# EAGLE schematic V2.1_BMS (EAGLE 9.6.2)

## Sheet 1 of 7: ISOLATED SUPPLY
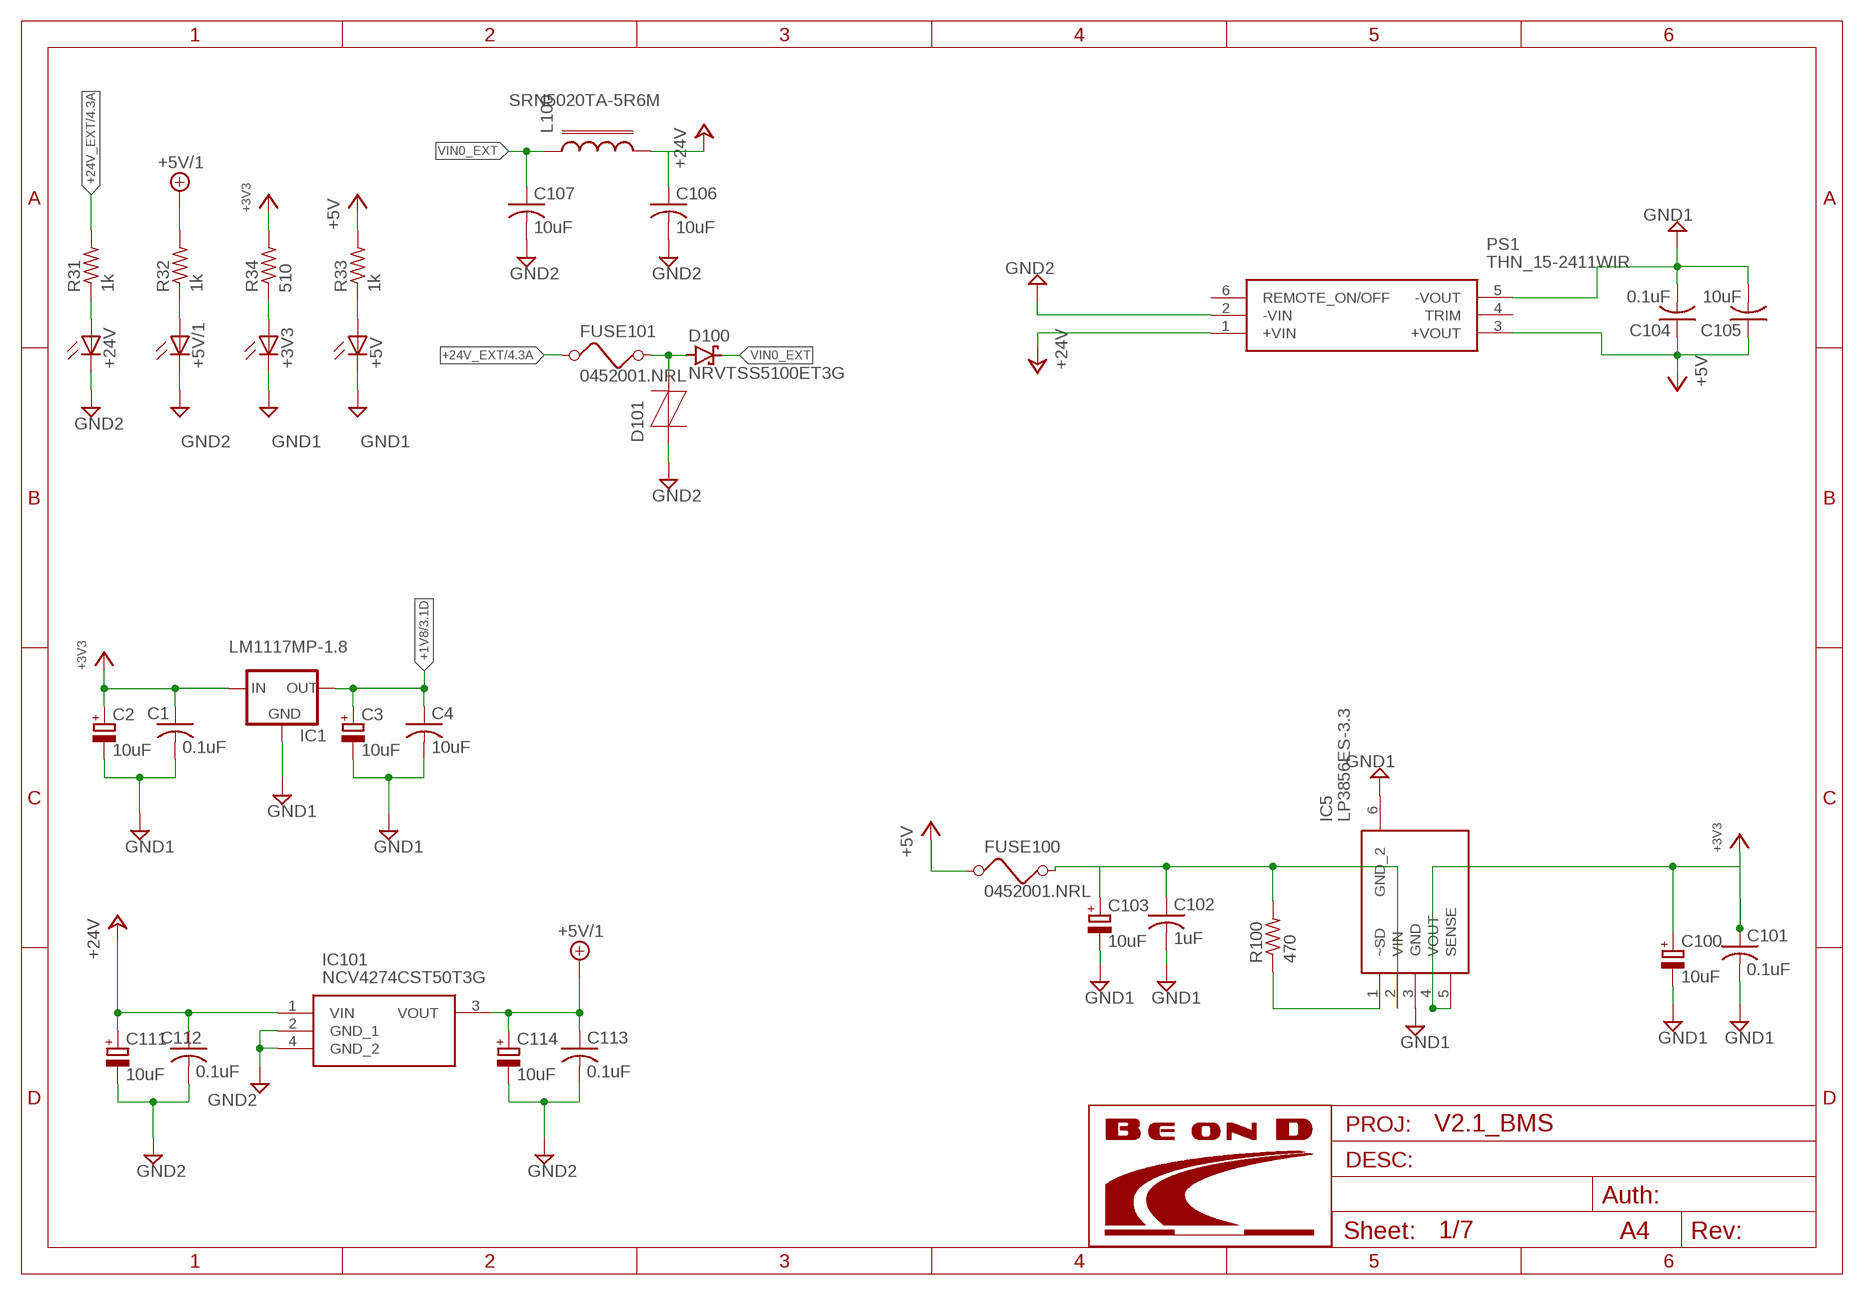
[diagram p0: schematic, sheet 1]

### Parts
+3V3  LED0603  [LED-0603]
+5V  LED0603  [LED-0603]
+5V/1  LED0603  [LED-0603]
+24V  LED0603  [LED-0603]
C1  0.1uF  CAPACITORBEOND_0603  [0603_INCH:1]
C2  10uF  C-POL_TANTALUM-1411(3528-METRIC)  [CAPMP3528X210N]
C3  10uF  C-POL_TANTALUM-1411(3528-METRIC)  [CAPMP3528X210N]
C4  10uF  CAPACITORBEOND_0603  [0603_INCH:1]
C100  10uF  C-POL_TANTALUM-1411(3528-METRIC)  [CAPMP3528X210N]
C101  0.1uF  CAPACITORBEOND_0603  [0603_INCH:1]
C102  1uF  CAPACITORBEOND_0603  [0603_INCH:1]
C103  10uF  C-POL_TANTALUM-1411(3528-METRIC)  [CAPMP3528X210N]
C104  0.1uF  CAPACITORBEOND_0603  [0603_INCH:1]
C105  10uF  CAPACITORBEOND_0603  [0603_INCH:1]
C106  10uF  CAPACITORBEOND_0603  [0603_INCH:1]
C107  10uF  CAPACITORBEOND_0603  [0603_INCH:1]
C111  10uF  C-POL_TANTALUM-1411(3528-METRIC)  [CAPMP3528X210N]
C112  0.1uF  CAPACITORBEOND_0603  [0603_INCH:1]
C113  0.1uF  CAPACITORBEOND_0603  [0603_INCH:1]
C114  10uF  C-POL_TANTALUM-1411(3528-METRIC)  [CAPMP3528X210N]
D100  NRVTSS5100ET3G  [LIBRARY_DIODES_FUSE_SMB-2]
D101  P0300SCLRP  [LIBRARY_DIODES_FUSE_SMB]
FUSE100  0452001.NRL  045201.5MRL  [LIBRARY_DIODES_FUSE_452_454]
FUSE101  0452001.NRL  045201.5MRL  [LIBRARY_DIODES_FUSE_452_454]
IC1  LM1117MP-1.8  [SOT223:1]
IC5  LP3856ES-3.3  [TO170P1435X465-6N]
IC101  NCV4274CST50T3G  [SOT223]
L100  SRN5020TA-5R6M  [LIBRARY_DIODES_FUSE_L_5X5]
PS1  THN_15-2411WIR  [THN152415WIR]
R31  1k  RESISTOR0603  [0603_INCH]
R32  1k  RESISTOR0603  [0603_INCH]
R33  1k  RESISTOR0603  [0603_INCH]
R34  510  RESISTOR0603  [0603_INCH]
R100  470  RESISTOR0603  [0603_INCH]

### Nets
+1V8: C3.1(+) C4.1 IC1.2(OUT) IC1.4(OUT) ; also sheet 3
+3V3: C1.1 C2.1(+) C100.1(+) C101.1 IC1.3(IN) IC5.4(VOUT) IC5.5(SENSE) R34.2 ; also sheet 2,3,4,5,6,7
+5V: C104.1 C105.1 FUSE100.P$1 PS1.3(+VOUT) R33.2 ; also sheet 3
+5V/1: C113.1 C114.1(+) IC101.3(VOUT) R32.2 ; also sheet 4
+24V: C106.1 C111.1(+) C112.1 IC101.1(VIN) L100.P$2 PS1.1(+VIN)
+24V_EXT: FUSE101.P$1 R31.2 ; also sheet 4
GND1: +3V3.C +5V.C C1.2 C2.2(-) C3.2(-) C4.2 C100.2(-) C101.2 C102.2 C103.2(-) C104.2 C105.2 IC1.1(GND) IC5.3(GND) IC5.6(GND_2) PS1.5(-VOUT) ; also sheet 2,3,4,5,6,7
GND2: +5V/1.C +24V.C C106.2 C107.2 C111.2(-) C112.2 C113.2 C114.2(-) D101.2(T) IC101.2(GND_1) IC101.4(GND_2) PS1.2(-VIN) ; also sheet 4
N$1: C102.1 C103.1(+) FUSE100.P$2 IC5.2(VIN) R100.2
N$2: D100.A D101.1(R) FUSE101.P$2
N$3: IC5.1(~SD) R100.1
N$23: +5V/1.A R32.1
N$24: +5V.A R33.1
N$35: +24V.A R31.1
N$36: +3V3.A R34.1
VIN0_EXT: C107.1 D100.C L100.P$1
Unconnected: PS1.4(TRIM) PS1.6(REMOTE_ON/OFF)

## Sheet 2 of 7: RGB LED
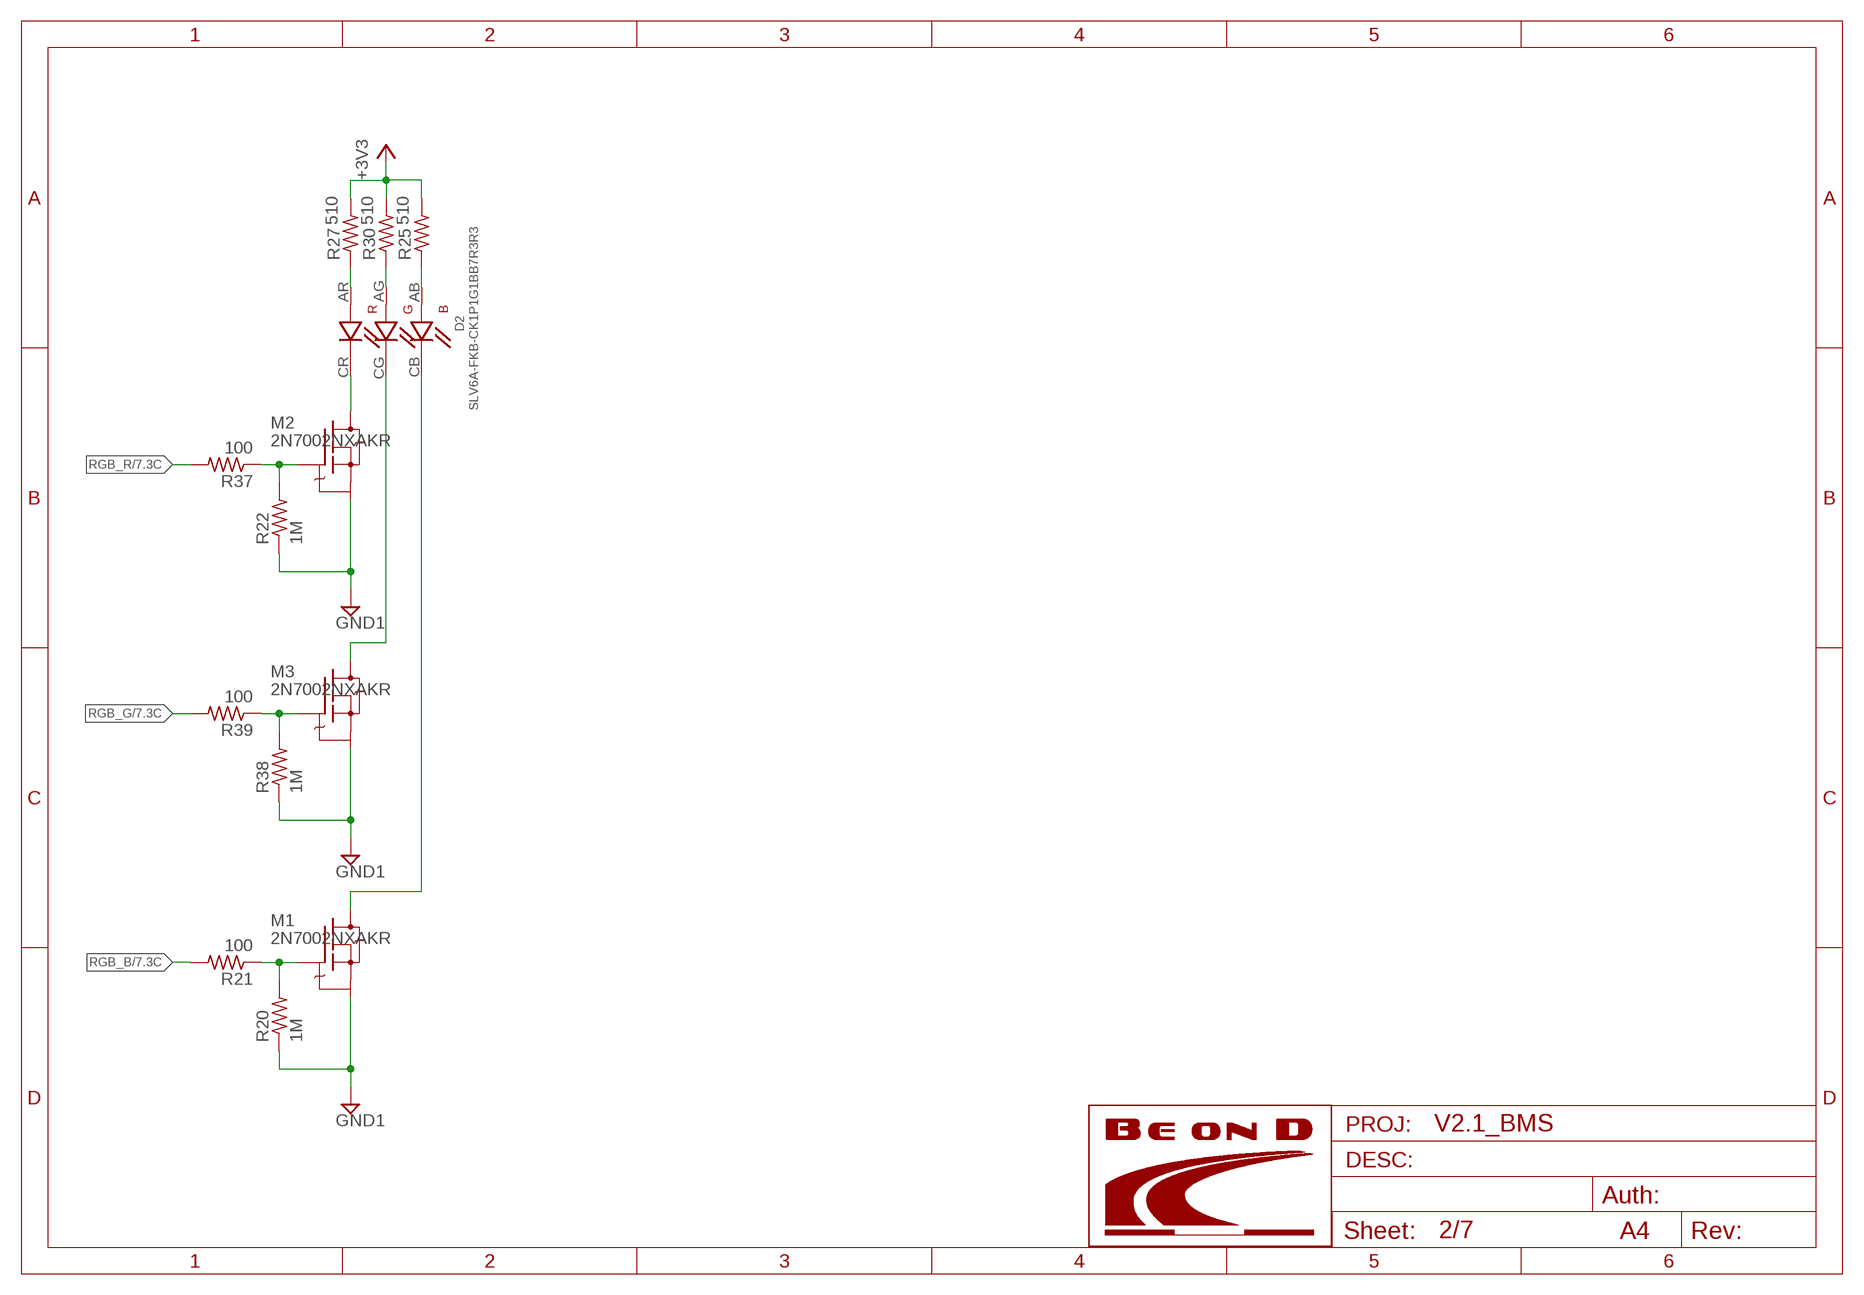
[diagram p1: schematic, sheet 2]

### Parts
D2  SLV6A-FKB-CK1P1G1BB7R3R3  [PLCC-6-LED_PLCC-6-LED]
M1  2N7002NXAKR  [BEOND_SOT23]
M2  2N7002NXAKR  [BEOND_SOT23]
M3  2N7002NXAKR  [BEOND_SOT23]
R20  1M  RESISTOR0603  [0603_INCH]
R21  100  RESISTOR0603  [0603_INCH]
R22  1M  RESISTOR0603  [0603_INCH]
R25  510  RESISTOR0603  [0603_INCH]
R27  510  RESISTOR0603  [0603_INCH]
R30  510  RESISTOR0603  [0603_INCH]
R37  100  RESISTOR0603  [0603_INCH]
R38  1M  RESISTOR0603  [0603_INCH]
R39  100  RESISTOR0603  [0603_INCH]

### Nets
+3V3: R25.2 R27.2 R30.2 ; also sheet 1,3,4,5,6,7
GND1: M1.2(S) M2.2(S) M3.2(S) R20.1 R22.1 R38.1 ; also sheet 1,3,4,5,6,7
N$40: D2.AR(RA) R27.1
N$41: D2.AG(GA) R30.1
N$42: D2.AB(BA) R25.1
N$44: M3.1(G) R38.2 R39.1
N$45: D2.CG(GC) M3.3(D)
N$46: M1.1(G) R20.2 R21.1
N$47: D2.CB(BC) M1.3(D)
N$48: M2.1(G) R22.2 R37.1
N$49: D2.CR(RC) M2.3(D)
RGB_B: R21.2 ; also sheet 7
RGB_G: R39.2 ; also sheet 7
RGB_R: R37.2 ; also sheet 7

## Sheet 3 of 7: PCIE LTE MODULE
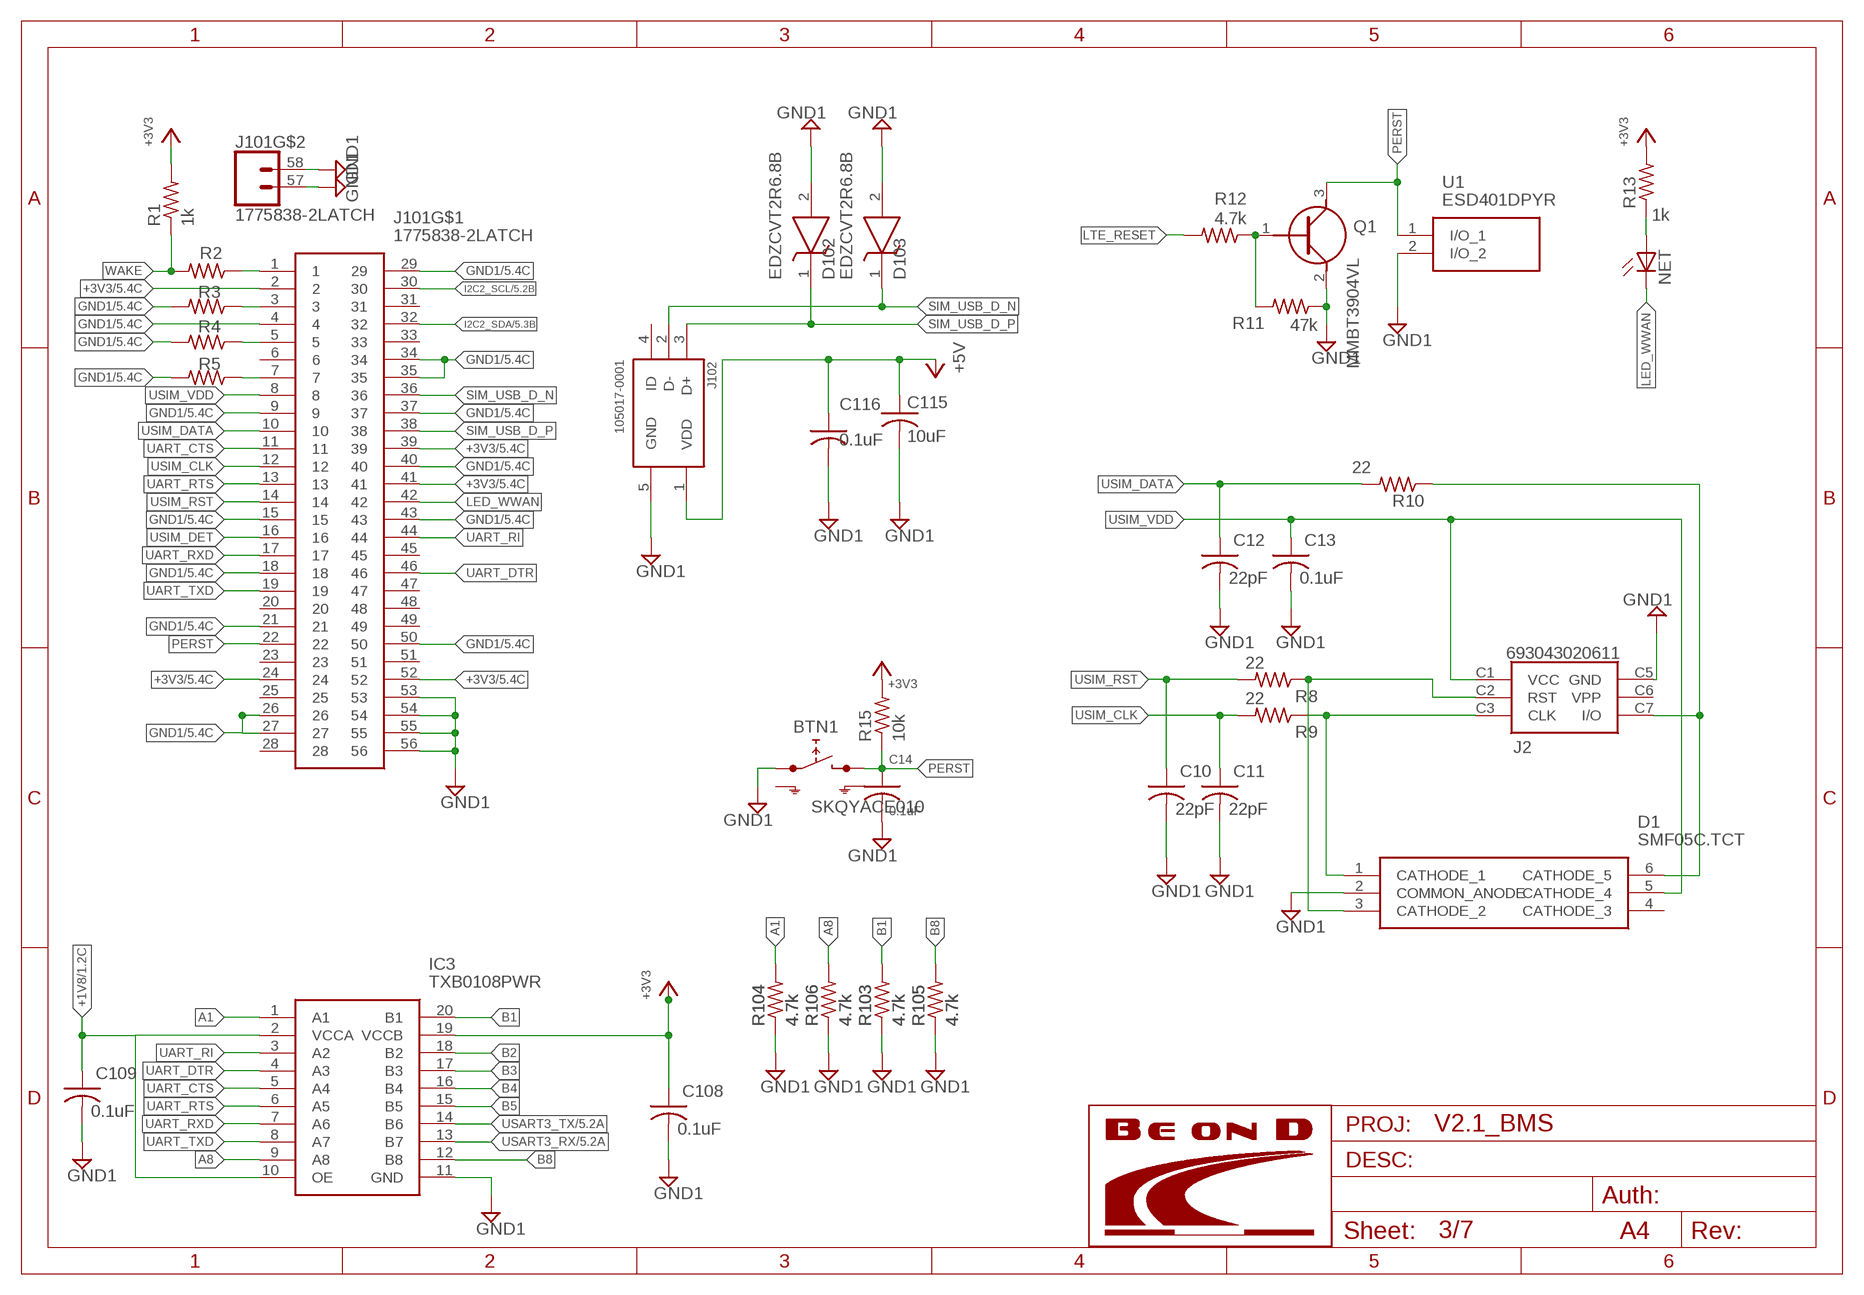
[diagram p2: schematic, sheet 3]

### Parts
BTN1  SKQYACE010  [BOTON_LED_SKQYACE010]
C10  22pF  CAPACITORBEOND_0603  [0603_INCH:1]
C11  22pF  CAPACITORBEOND_0603  [0603_INCH:1]
C12  22pF  CAPACITORBEOND_0603  [0603_INCH:1]
C13  0.1uF  CAPACITORBEOND_0603  [0603_INCH:1]
C14  0.1uF  CAPACITORBEOND_0603  [0603_INCH:1]
C108  0.1uF  CAPACITORBEOND_0603  [0603_INCH:1]
C109  0.1uF  CAPACITORBEOND_0603  [0603_INCH:1]
C115  10uF  CAPACITORBEOND_0603  [0603_INCH:1]
C116  0.1uF  CAPACITORBEOND_0603  [0603_INCH:1]
D1  SMF05C.TCT  [SOT65P210X110-6N]
D102  EDZCVT2R6.8B  [SODFL1608X70N]
D103  EDZCVT2R6.8B  [SODFL1608X70N]
IC3  TXB0108PWR  [SOP65P640X120-20N]
J2  693043020611  [693043020611]
J101  1775838-2LATCH  [17758382_LATCH]
J102  105017-0001  [MOLEX_105017-0001]
NET  LED0603  [LED-0603]
Q1  MMBT3904VL  [SOT95P230X110-3N]
R1  1k  RESISTOR0603  [0603_INCH]
R2  0  RESISTOR0603  [0603_INCH]
R3  0  RESISTOR0603  [0603_INCH]
R4  0  RESISTOR0603  [0603_INCH]
R5  0  RESISTOR0603  [0603_INCH]
R8  22  RESISTOR0603  [0603_INCH]
R9  22  RESISTOR0603  [0603_INCH]
R10  22  RESISTOR0603  [0603_INCH]
R11  47k  RESISTOR0603  [0603_INCH]
R12  4.7k  RESISTOR0603  [0603_INCH]
R13  1k  RESISTOR0603  [0603_INCH]
R15  10k  RESISTOR0603  [0603_INCH]
R103  4.7k  RESISTOR0603  [0603_INCH]
R104  4.7k  RESISTOR0603  [0603_INCH]
R105  4.7k  RESISTOR0603  [0603_INCH]
R106  4.7k  RESISTOR0603  [0603_INCH]
U1  ESD401DPYR  [ESD401DPYR]

### Nets
+1V8: C109.1 IC3.2(VCCA) IC3.10(OE) ; also sheet 1
+3V3: C108.1 IC3.19(VCCB) J101.2 J101.24 J101.39 J101.41 J101.52 R1.2 R13.2 R15.2 ; also sheet 1,2,4,5,6,7
+5V: C115.1 C116.1 J102.1(VDD) ; also sheet 1
_USIM_CLK: D1.1(CATHODE_1) J2.C3(CLK) R9.1
_USIM_DATA: D1.6(CATHODE_5) J2.C7(I/O) R10.1
A1: IC3.1(A1) R104.2
A8: IC3.9(A8) R106.2
B1: IC3.20(B1) R103.2
B2: IC3.18(B2)
B3: IC3.17(B3)
B4: IC3.16(B4)
B5: IC3.15(B5)
B8: IC3.12(B8) R105.2
GND1: BTN1.1(1.1) C10.2 C11.2 C12.2 C13.2 C14.2 C108.2 C109.2 C115.2 C116.2 D1.2(COMMON_ANODE) D102.2(A) D103.2(A) IC3.11(GND) J2.C5(GND) J101.4 J101.9 J101.15 J101.18 J101.21 J101.26 J101.27 J101.29 J101.34 J101.35 J101.37 J101.40 J101.43 J101.50 J101.53 J101.54 J101.55 J101.56 J101.57 J101.58 J102.5(GND) Q1.2(E) R3.2 R4.2 R5.2 R11.1 R103.1 R104.1 R105.1 R106.1 U1.2(I/O_2) ; also sheet 1,2,4,5,6,7
I2C2_SCL: J101.30 ; also sheet 5,7
I2C2_SDA [uC]: J101.32 ; also sheet 5,7
LED_WWAN: J101.42 NET.C
LTE_RESET: R12.2
N$7: J101.3 R3.1
N$8: J101.5 R4.1
N$12: Q1.1(B) R11.2 R12.1
N$13: NET.A R13.1
N$15: D1.3(CATHODE_2) J2.C2(RST) R8.1
N$18: J101.7 R5.1
N$19: J101.1 R2.1
PERST: BTN1.2(2.1) C14.1 J101.22 Q1.3(C) R15.1 U1.1(I/O_1)
SIM_USB_D_N: D103.1(K) J101.36 J102.2(D-)
SIM_USB_D_P: D102.1(K) J101.38 J102.3(D+)
UART_CTS: IC3.5(A4) J101.11
UART_DTR: IC3.4(A3) J101.46
UART_RI: IC3.3(A2) J101.44
UART_RTS: IC3.6(A5) J101.13
UART_RXD: IC3.7(A6) J101.17
UART_TXD: IC3.8(A7) J101.19
USART3_RX: IC3.13(B7) ; also sheet 5,7
USART3_TX: IC3.14(B6) ; also sheet 5,7
USIM_CLK: C11.1 J101.12 R9.2
USIM_DATA: C12.1 J101.10 R10.2
USIM_DET: J101.16
USIM_RST: C10.1 J101.14 R8.2
USIM_VDD: C13.1 D1.5(CATHODE_4) J2.C1(VCC) J101.8
WAKE: R1.1 R2.2
Unconnected: BTN1.GND1(SH) BTN1.GND2(SH1) D1.4(CATHODE_3) J2.C6(VPP) J101.6 J101.20 J101.23 J101.25 J101.28 J101.31 J101.33 J101.45 J101.47 J101.48 J101.49 J101.51 J102.4(ID)

## Sheet 4 of 7: ISOLATED CAN INTERFACE
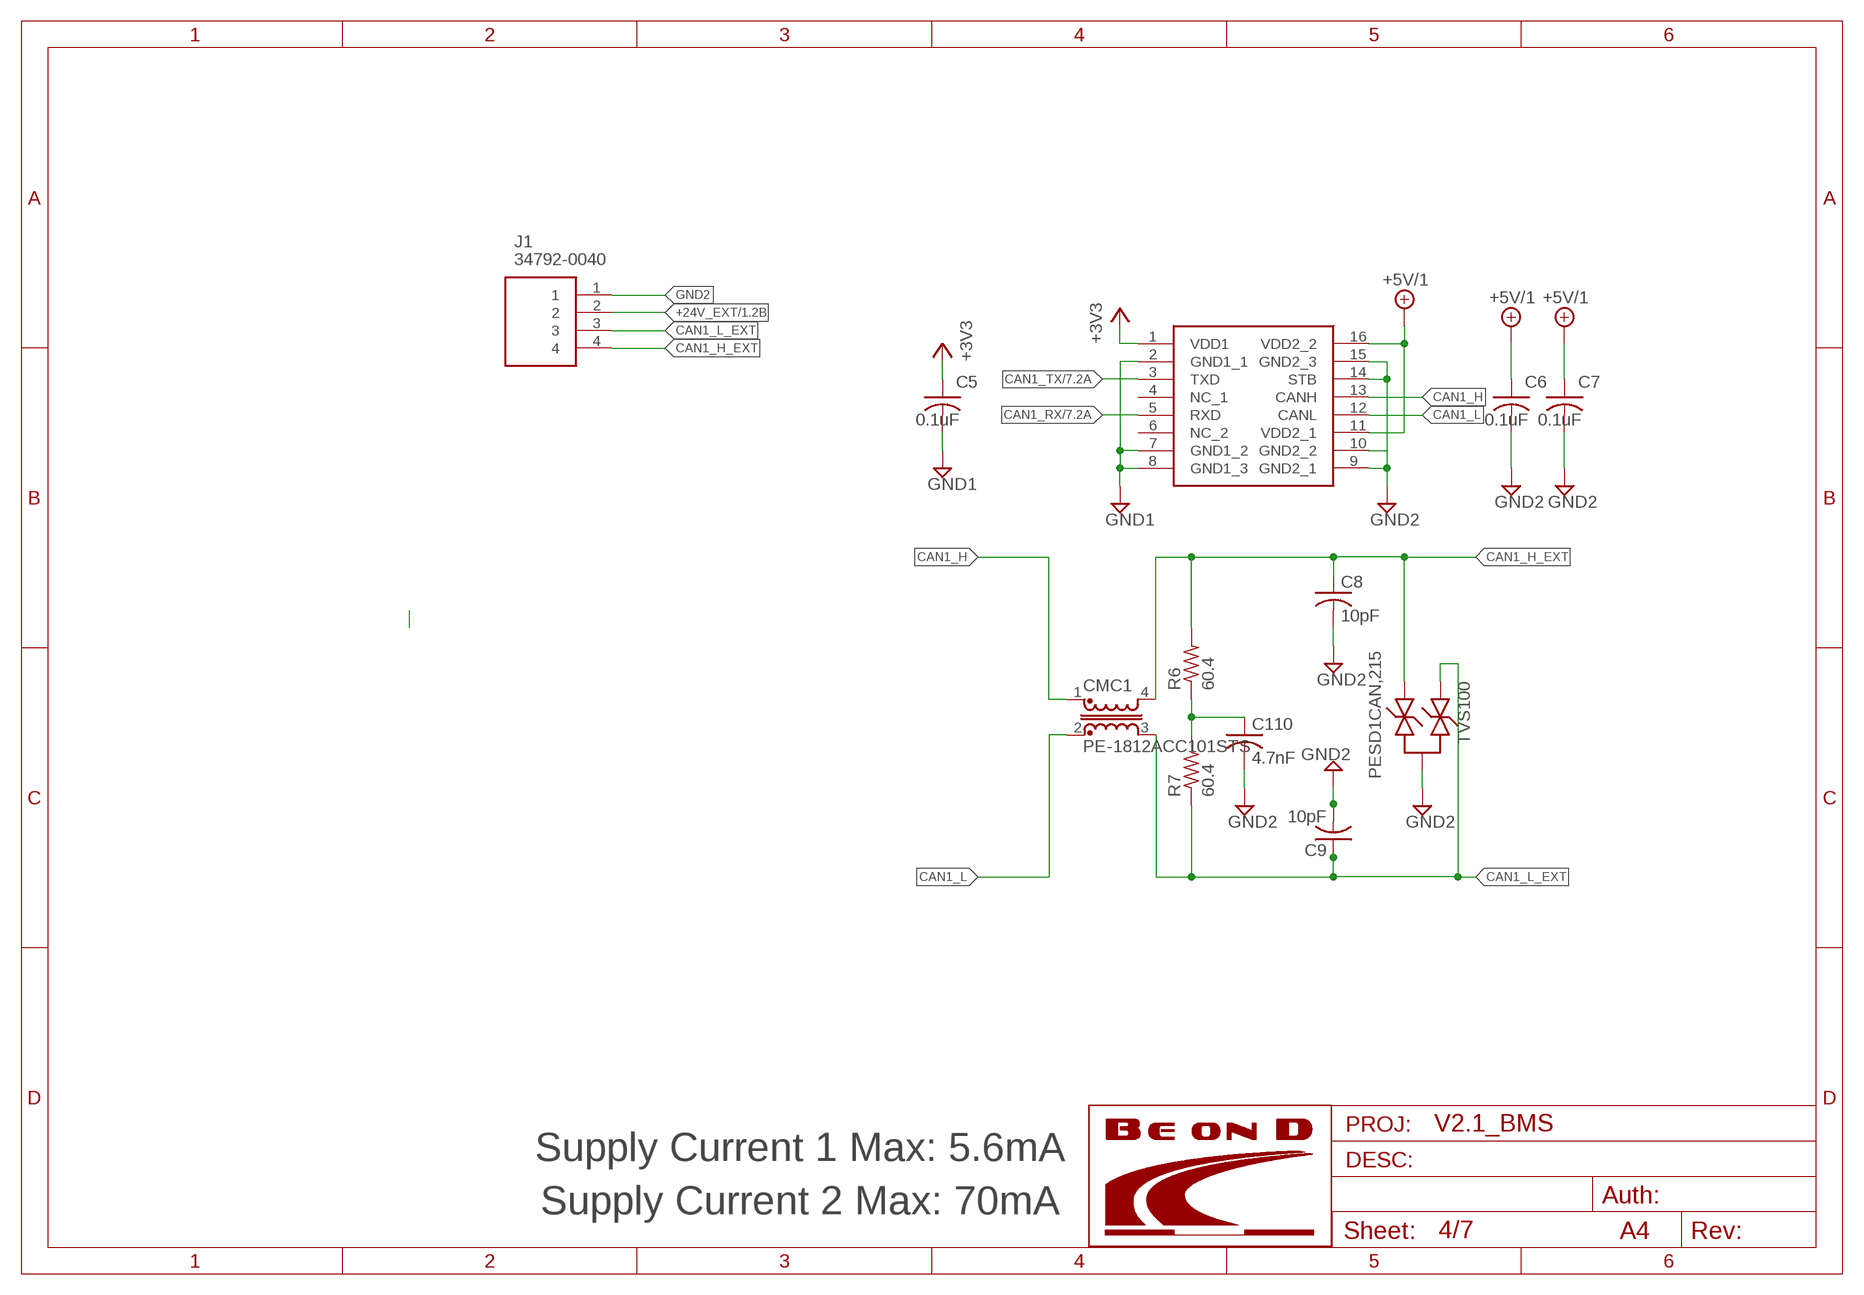
[diagram p3: schematic, sheet 4]

### Parts
C5  0.1uF  CAPACITORBEOND_0603  [0603_INCH:1]
C6  0.1uF  CAPACITORBEOND_0603  [0603_INCH:1]
C7  0.1uF  CAPACITORBEOND_0603  [0603_INCH:1]
C8  10pF  CAPACITORBEOND_0603  [0603_INCH:1]
C9  10pF  CAPACITORBEOND_0603  [0603_INCH:1]
C110  4.7nF  CAPACITORBEOND_0603  [0603_INCH:1]
CMC1  PE-1812ACC101STS  PE-1812ACC510STS  [BEOND_L_1812ACC]
IC2  TJA1052IT/2Y  [TJA1052IT_2Y_SOIC127P1032X265-16N]
J1  34792-0040  [347920040]
R6  60.4  RESISTOR0603  [0603_INCH]
R7  60.4  RESISTOR0603  [0603_INCH]
TVS100  PESD1CAN,215  PESD1CAN,215  [BEOND_SOT23]

### Nets
+3V3: C5.1 IC2.1(VDD1) ; also sheet 1,2,3,5,6,7
+5V/1: C6.1 C7.1 IC2.11(VDD2_1) IC2.16(VDD2_2) ; also sheet 1
+24V_EXT: J1.2 ; also sheet 1
CAN1_H: CMC1.1 IC2.13(CANH)
CAN1_H_EXT: C8.1 CMC1.4 J1.4 R6.2 TVS100.2
CAN1_L: CMC1.2 IC2.12(CANL)
CAN1_L_EXT: C9.1 CMC1.3 J1.3 R7.1 TVS100.1
CAN1_RX: IC2.5(RXD) ; also sheet 7
CAN1_TX: IC2.3(TXD) ; also sheet 7
GND1: C5.2 IC2.2(GND1_1) IC2.7(GND1_2) IC2.8(GND1_3) ; also sheet 1,2,3,5,6,7
GND2: C6.2 C7.2 C8.2 C9.2 C110.2 IC2.9(GND2_1) IC2.10(GND2_2) IC2.14(STB) IC2.15(GND2_3) J1.1 TVS100.3 ; also sheet 1
N$11: C110.1 R6.1 R7.2
Unconnected: IC2.4(NC_1) IC2.6(NC_2)

### Notes on the sheet
- Supply Current 1 Max: 5.6mA
- Supply Current 2 Max: 70mA

## Sheet 5 of 7: MCU
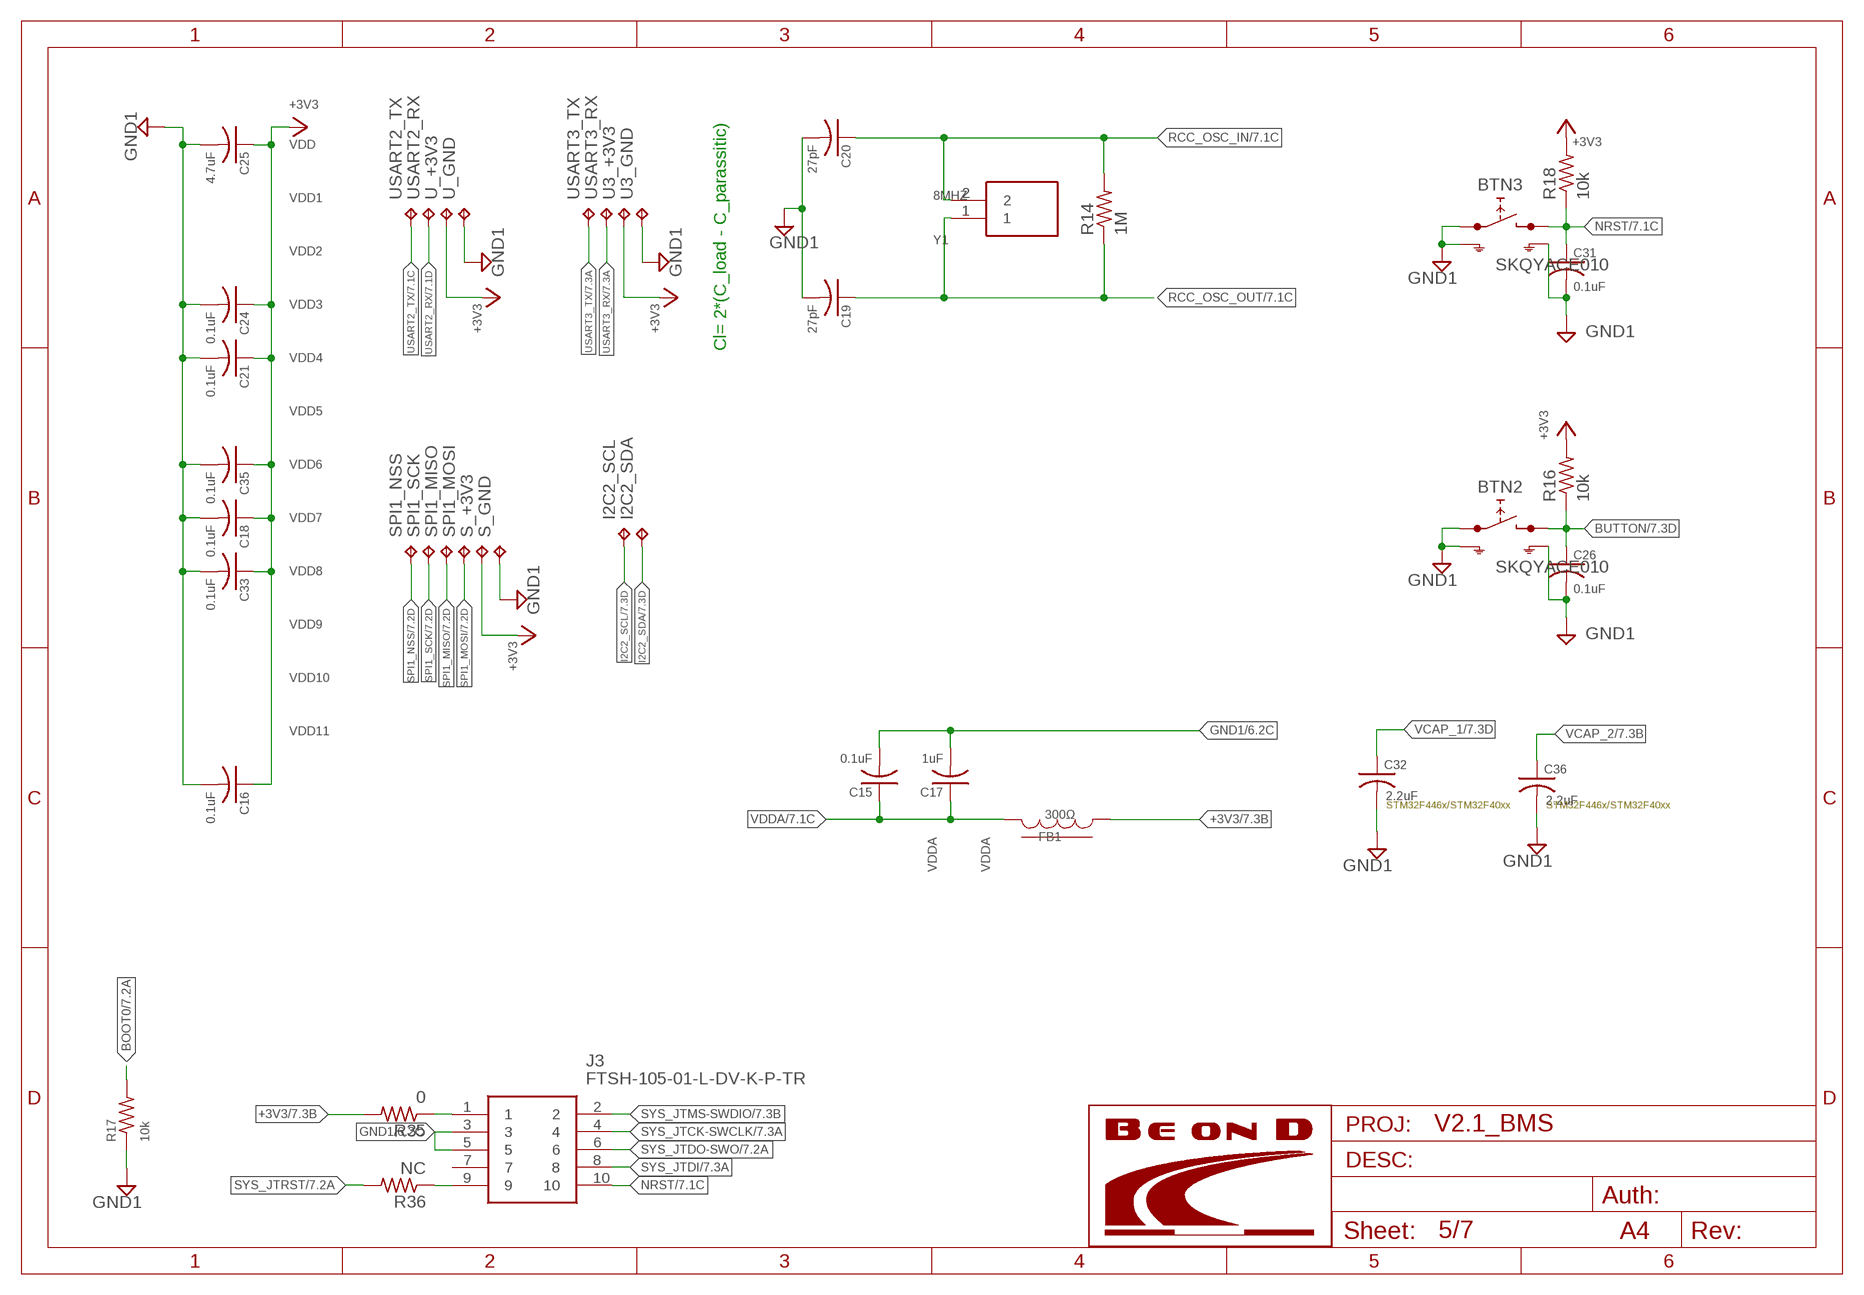
[diagram p4: schematic, sheet 5]

### Parts
BTN2  SKQYACE010  [BOTON_LED_SKQYACE010]
BTN3  SKQYACE010  [BOTON_LED_SKQYACE010]
C15  0.1uF  CAPACITORBEOND_0603  [0603_INCH:1]
C16  0.1uF  CAPACITORBEOND_0603  [0603_INCH:1]
C17  1uF  CAPACITORBEOND_0603  [0603_INCH:1]
C18  0.1uF  CAPACITORBEOND_0603  [0603_INCH:1]
C19  27pF  CAPACITOR0603  [0603_INCH]
C20  27pF  CAPACITOR0603  [0603_INCH]
C21  0.1uF  CAPACITORBEOND_0603  [0603_INCH:1]
C24  0.1uF  CAPACITORBEOND_0603  [0603_INCH:1]
C25  4.7uF  CAPACITORBEOND_0603  [0603_INCH:1]
C26  0.1uF  CAPACITOR0603  [0603_INCH]
C31  0.1uF  CAPACITOR0603  [0603_INCH]
C32  2.2uF  CAPACITORBEOND_0603  [0603_INCH:1]
C33  0.1uF  CAPACITORBEOND_0603  [0603_INCH:1]
C35  0.1uF  CAPACITORBEOND_0603  [0603_INCH:1]
C36  2.2uF  CAPACITORBEOND_0603  [0603_INCH:1]
FB1  300Ω  FERRITE-BEAD0603  [0603_INCH]
I2C2_SCL  TPTP09R  [TP09R]
I2C2_SDA  TPTP09R  [TP09R]
J3  FTSH-105-01-L-DV-K-P-TR  [FTSH10501LDVKPTR]
R14  1M  RESITOR0603  [0603_INCH]
R16  10k  RESITOR0603  [0603_INCH]
R17  10k  RESITOR0603  [0603_INCH]
R18  10k  RESITOR0603  [0603_INCH]
R35  0  RESITOR0603  [0603_INCH]
R36  NC  RESITOR0603  [0603_INCH]
S_+3V3  TPTP09R  [TP09R]
S_GND  TPTP09SQ  [TP09SQ]
SPI1_MISO  TPTP09R  [TP09R]
SPI1_MOSI  TPTP09R  [TP09R]
SPI1_NSS  TPTP09R  [TP09R]
SPI1_SCK  TPTP09R  [TP09R]
U3_+3V3  TPTP09R  [TP09R]
U3_GND  TPTP09SQ  [TP09SQ]
U_+3V3  TPTP09R  [TP09R]
U_GND  TPTP09SQ  [TP09SQ]
USART2_RX  TPTP09R  [TP09R]
USART2_TX  TPTP09R  [TP09R]
USART3_RX  TPTP09R  [TP09R]
USART3_TX  TPTP09R  [TP09R]
Y1  8MHZ  NX3225GD-8MHZ-STD-CRA-3  [RESC3226X100N]

### Nets
+3V1: U3_+3V3.TP ; supply symbol labelled +3V3
+3V3: C16.1 C18.1 C21.1 C24.1 C25.1 C33.1 C35.1 FB1.1 R16.2 R18.2 R35.2 S_+3V3.TP U_+3V3.TP ; also sheet 1,2,3,4,6,7
BOOT0: R17.2 ; also sheet 7
BUTTON: BTN2.2(2.1) C26.1 R16.1 ; also sheet 7
GND1: BTN2.1(1.1) BTN2.GND1(SH) BTN2.GND2(SH1) BTN3.1(1.1) BTN3.GND1(SH) BTN3.GND2(SH1) C15.2 C16.2 C17.2 C18.2 C19.2 C20.2 C21.2 C24.2 C25.2 C26.2 C31.2 C32.2 C33.2 C35.2 C36.2 J3.3 J3.5 R17.1 S_GND.TP U_GND.TP ; also sheet 1,2,3,4,6,7
GND3: U3_GND.TP ; supply symbol labelled GND1
I2C2_SCL: I2C2_SCL.TP ; also sheet 3,7
I2C2_SDA [uC]: I2C2_SDA.TP ; also sheet 3,7
N$37: J3.1 R35.1
N$38: J3.9 R36.1
NRST: BTN3.2(2.1) C31.1 J3.10 R18.1 ; also sheet 7
RCC_OSC_IN: C20.1 R14.2 Y1.2 ; also sheet 7
RCC_OSC_OUT: C19.1 R14.1 Y1.1 ; also sheet 7
SPI1_MISO: SPI1_MISO.TP ; also sheet 7
SPI1_MOSI: SPI1_MOSI.TP ; also sheet 7
SPI1_NSS: SPI1_NSS.TP ; also sheet 7
SPI1_SCK: SPI1_SCK.TP ; also sheet 7
SYS_JTCK-SWCLK: J3.4 ; also sheet 7
SYS_JTDI: J3.8 ; also sheet 7
SYS_JTDO-SWO: J3.6 ; also sheet 7
SYS_JTMS-SWDIO: J3.2 ; also sheet 7
SYS_JTRST: R36.2 ; also sheet 7
USART2_RX [uC]: USART2_RX.TP ; also sheet 7
USART2_TX: USART2_TX.TP ; also sheet 7
USART3_RX: USART3_RX.TP ; also sheet 3,7
USART3_TX: USART3_TX.TP ; also sheet 3,7
VCAP_1: C32.1 ; also sheet 7
VCAP_2 [uC]: C36.1 ; also sheet 7
VDDA: C15.1 C17.1 FB1.2 ; also sheet 7
Unconnected: J3.7

### Notes on the sheet
- VDD
- VDD1
- VDD2
- VDD3
- Cl= 2*(C_load - C_parassitic)
- VDD4
- VDD5
- VDD6
- VDD7
- VDD8
- VDD9
- VDD10
- VDD11
- STM32F446x/STM32F40xx | STM32F446x/STM32F40xx
- VDDA | VDDA

## Sheet 6 of 7
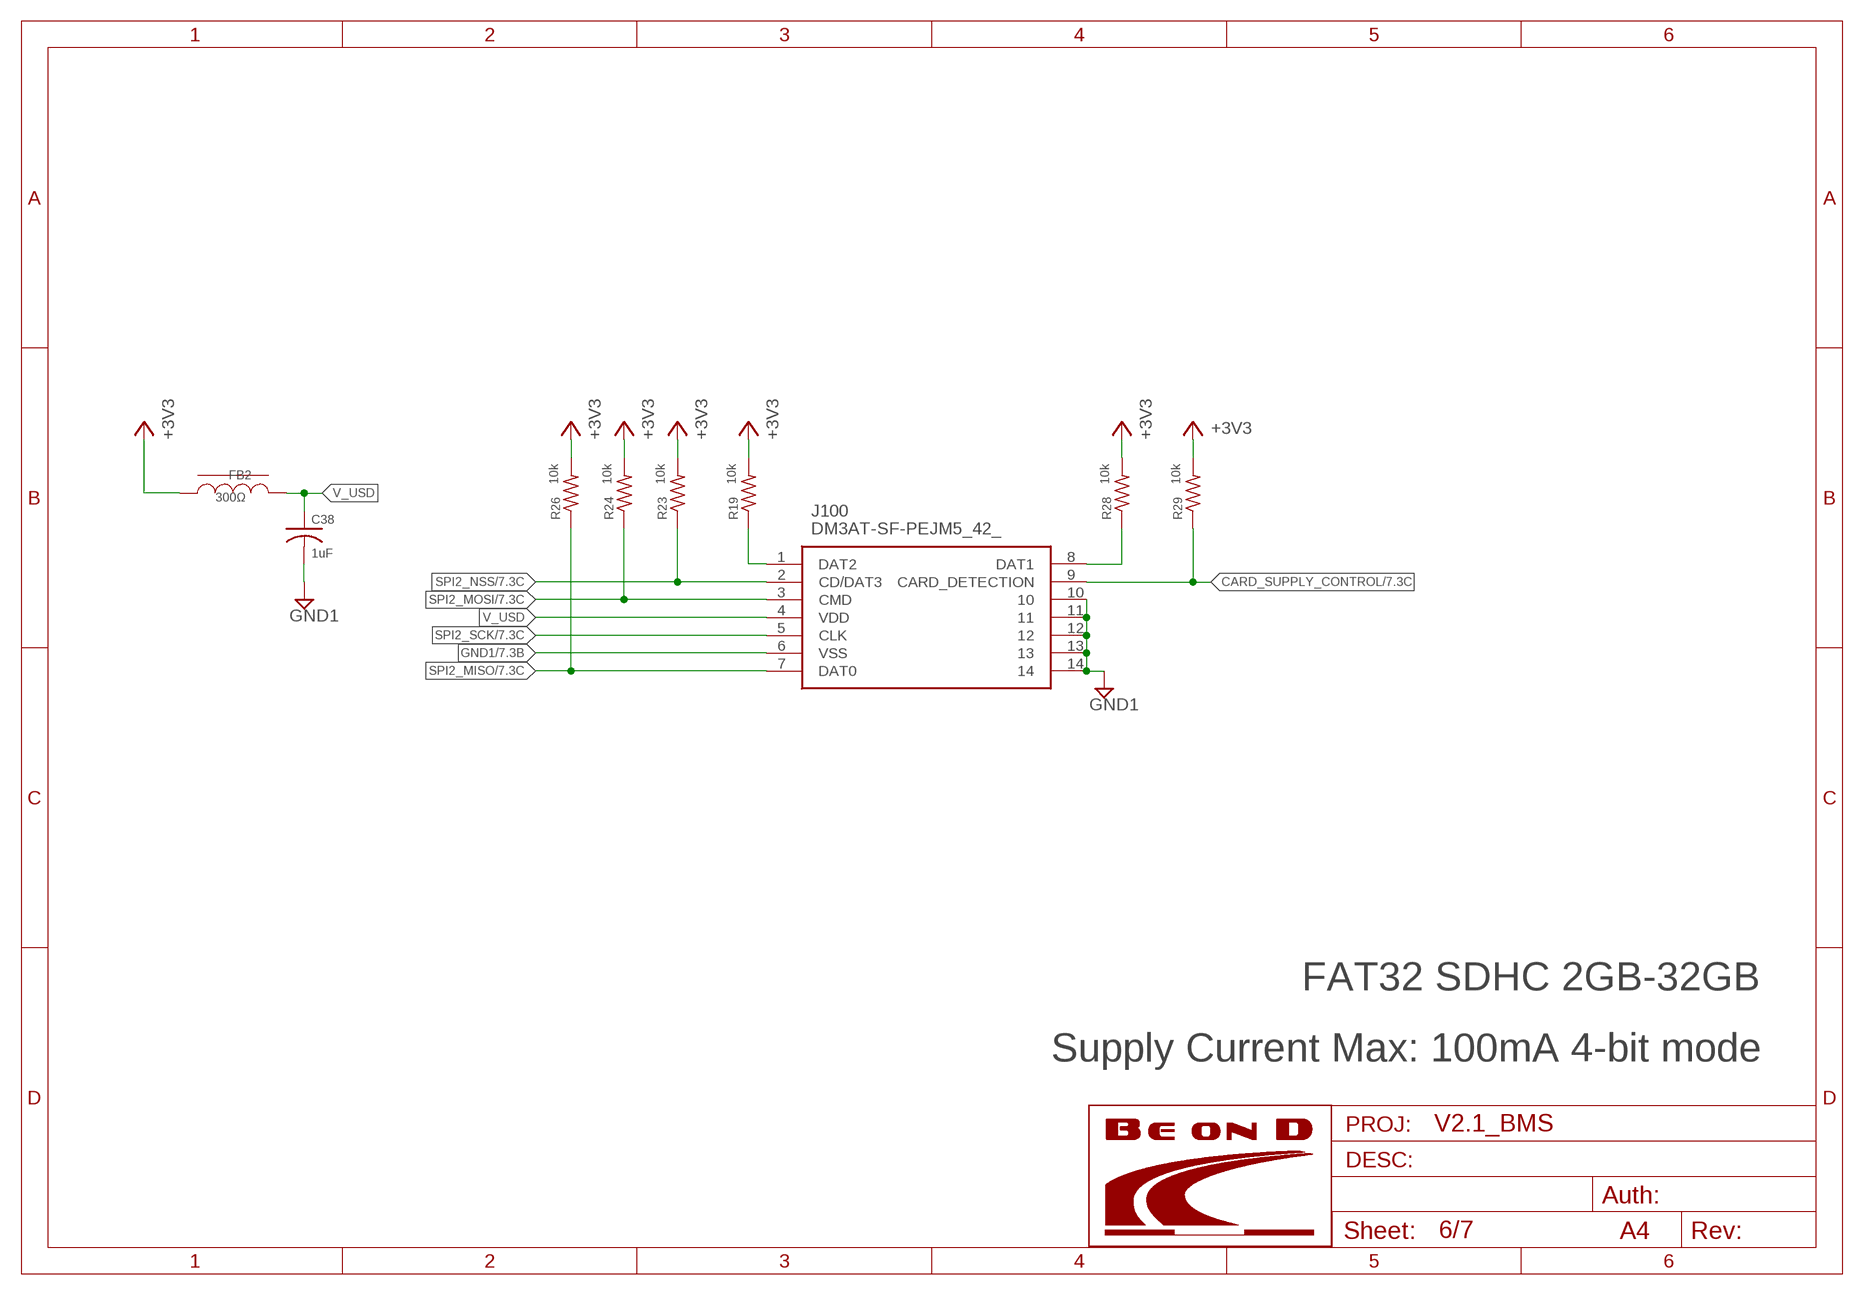
[diagram p5: schematic, sheet 6]

### Parts
C38  1uF  CAPACITOR0603  [0603_INCH]
FB2  300Ω  FERRITE-BEAD0603  [0603_INCH]
J100  DM3AT-SF-PEJM5_42_  [DM3ATSFPEJM542]
R19  10k  RESISTOR0603  [0603_INCH]
R23  10k  RESISTOR0603  [0603_INCH]
R24  10k  RESISTOR0603  [0603_INCH]
R26  10k  RESISTOR0603  [0603_INCH]
R28  10k  RESISTOR0603  [0603_INCH]
R29  10k  RESISTOR0603  [0603_INCH]

### Nets
+3V3: FB2.1 R19.2 R23.2 R24.2 R26.2 R28.2 R29.2 ; also sheet 1,2,3,4,5,7
CARD_SUPPLY_CONTROL: J100.9(CARD_DETECTION) R29.1 ; also sheet 7
GND1: C38.2 J100.6(VSS) J100.10 J100.11 J100.12 J100.13 J100.14 ; also sheet 1,2,3,4,5,7
N$14: J100.1(DAT2) R19.1
N$16: J100.8(DAT1) R28.1
SPI2_MISO: J100.7(DAT0) R26.1 ; also sheet 7
SPI2_MOSI: J100.3(CMD) R24.1 ; also sheet 7
SPI2_NSS: J100.2(CD/DAT3) R23.1 ; also sheet 7
SPI2_SCK: J100.5(CLK) ; also sheet 7
V_USD: C38.1 FB2.2 J100.4(VDD)

### Notes on the sheet
- FAT32 SDHC 2GB-32GB
- Supply Current Max: 100mA 4-bit mode

## Sheet 7 of 7
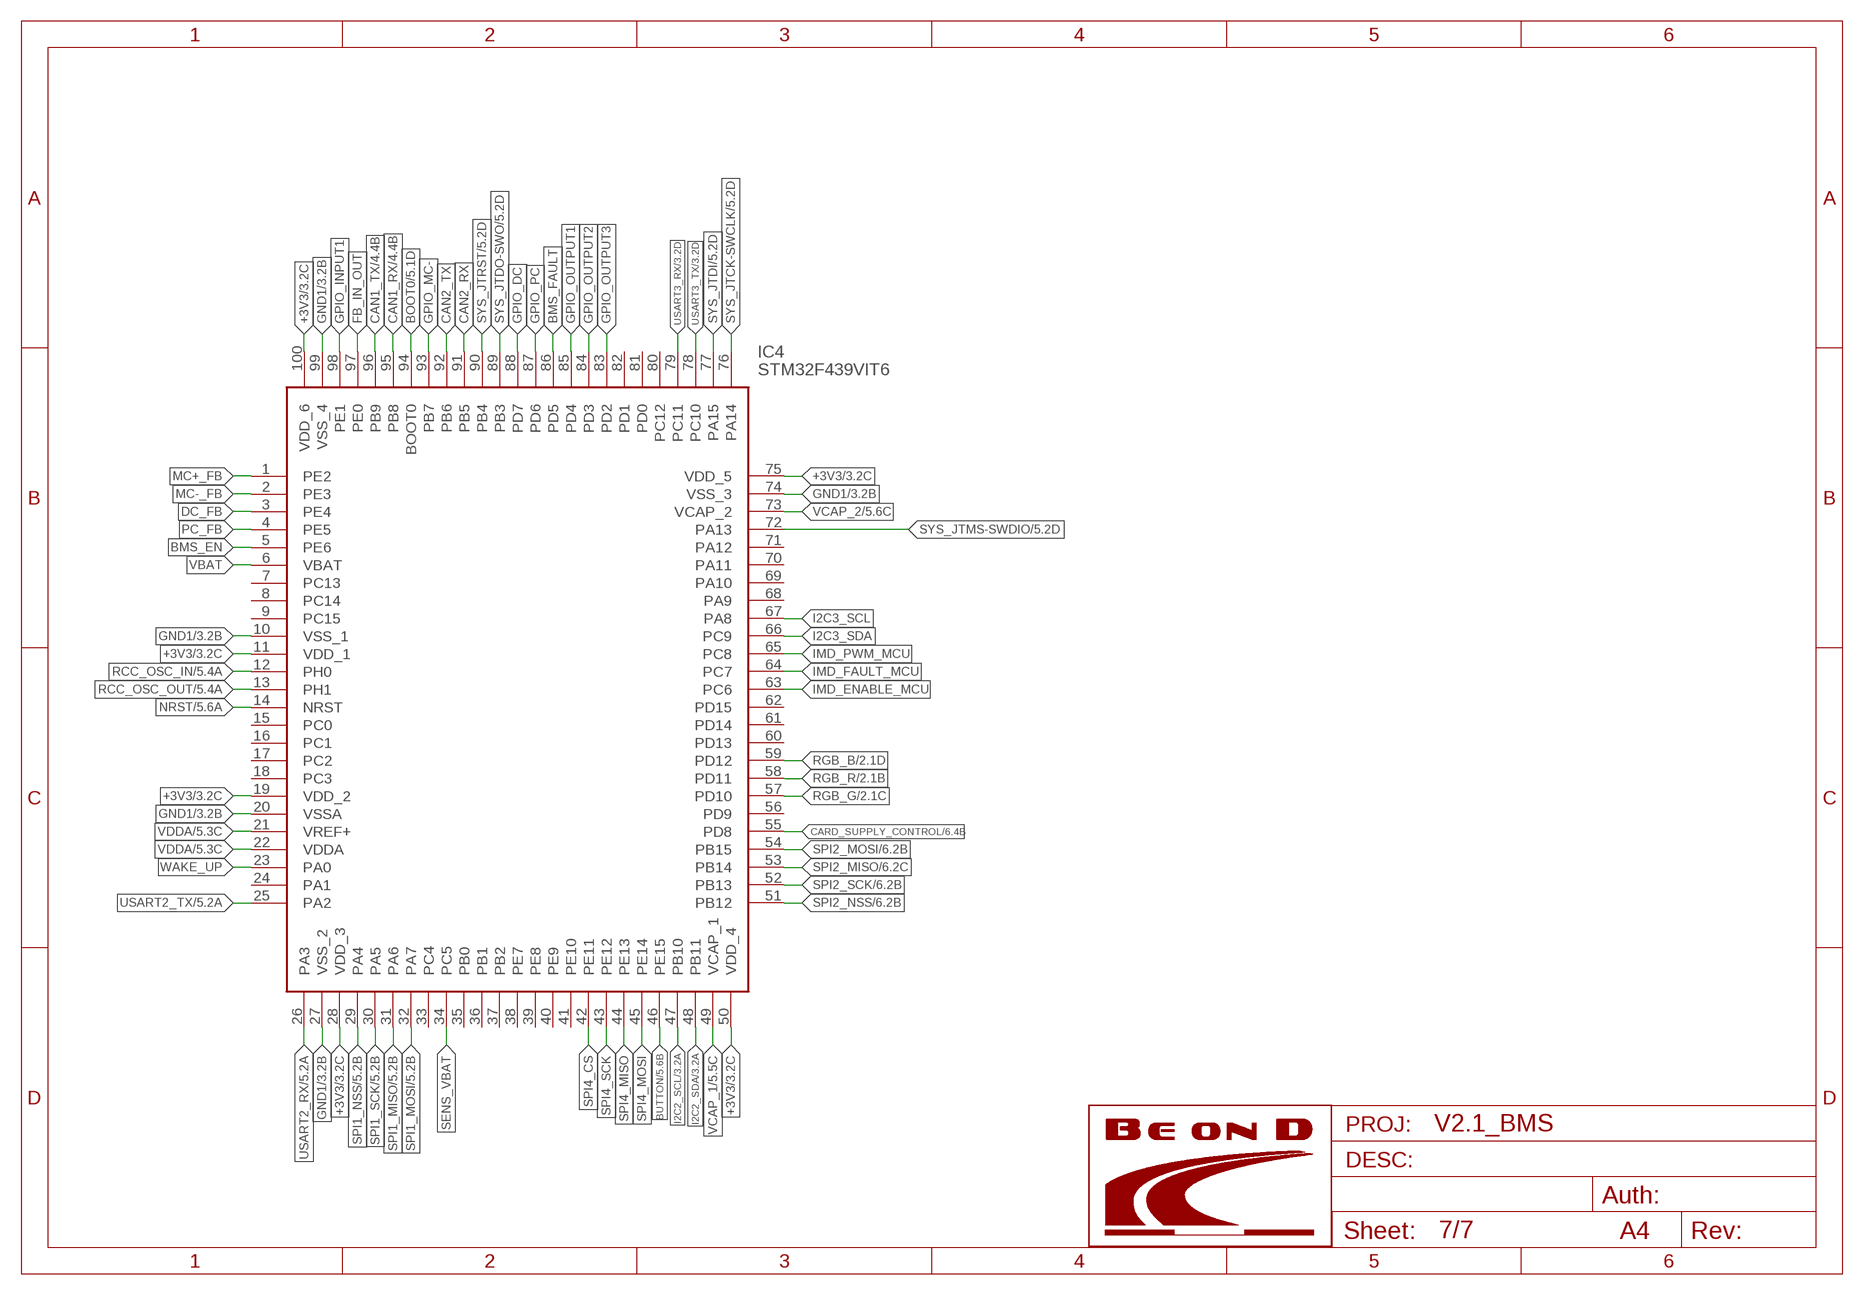
[diagram p6: schematic, sheet 7]

### Parts
IC4  STM32F439VIT6  [QFP50P1600X1600X160-100N]

### Nets
+3V3: IC4.11(VDD_1) IC4.19(VDD_2) IC4.28(VDD_3) IC4.50(VDD_4) IC4.75(VDD_5) IC4.100(VDD_6) ; also sheet 1,2,3,4,5,6
BMS_EN: IC4.5(PE6)
BMS_FAULT: IC4.86(PD5)
BOOT0: IC4.94(BOOT0) ; also sheet 5
BUTTON: IC4.46(PE15) ; also sheet 5
CAN1_RX: IC4.95(PB8) ; also sheet 4
CAN1_TX: IC4.96(PB9) ; also sheet 4
CAN2_RX [uC]: IC4.91(PB5)
CAN2_TX [uC]: IC4.92(PB6)
CARD_SUPPLY_CONTROL: IC4.55(PD8) ; also sheet 6
DC_FB: IC4.3(PE4)
FB_IN_OUT: IC4.97(PE0)
GND1: IC4.10(VSS_1) IC4.20(VSSA) IC4.27(VSS_2) IC4.74(VSS_3) IC4.99(VSS_4) ; also sheet 1,2,3,4,5,6
GPIO_DC [uC]: IC4.88(PD7)
GPIO_INPUT1: IC4.98(PE1)
GPIO_MC- [uC]: IC4.93(PB7)
GPIO_OUTPUT1: IC4.85(PD4)
GPIO_OUTPUT2: IC4.84(PD3)
GPIO_OUTPUT3: IC4.83(PD2)
GPIO_PC [uC]: IC4.87(PD6)
I2C2_SCL: IC4.47(PB10) ; also sheet 3,5
I2C2_SDA [uC]: IC4.48(PB11) ; also sheet 3,5
I2C3_SCL [uC]: IC4.67(PA8)
I2C3_SDA [uC]: IC4.66(PC9)
IMD_ENABLE_MCU: IC4.63(PC6)
IMD_FAULT_MCU [uC]: IC4.64(PC7)
IMD_PWM_MCU [uC]: IC4.65(PC8)
MC+_FB: IC4.1(PE2)
MC-_FB: IC4.2(PE3)
NRST: IC4.14(NRST) ; also sheet 5
PC_FB: IC4.4(PE5)
RCC_OSC_IN: IC4.12(PH0) ; also sheet 5
RCC_OSC_OUT: IC4.13(PH1) ; also sheet 5
RGB_B: IC4.59(PD12) ; also sheet 2
RGB_G: IC4.57(PD10) ; also sheet 2
RGB_R: IC4.58(PD11) ; also sheet 2
SENS_VBAT: IC4.34(PC5)
SPI1_MISO: IC4.31(PA6) ; also sheet 5
SPI1_MOSI: IC4.32(PA7) ; also sheet 5
SPI1_NSS: IC4.29(PA4) ; also sheet 5
SPI1_SCK: IC4.30(PA5) ; also sheet 5
SPI2_MISO: IC4.53(PB14) ; also sheet 6
SPI2_MOSI: IC4.54(PB15) ; also sheet 6
SPI2_NSS: IC4.51(PB12) ; also sheet 6
SPI2_SCK: IC4.52(PB13) ; also sheet 6
SPI4_CS: IC4.42(PE11)
SPI4_MISO: IC4.44(PE13)
SPI4_MOSI: IC4.45(PE14)
SPI4_SCK: IC4.43(PE12)
SYS_JTCK-SWCLK: IC4.76(PA14) ; also sheet 5
SYS_JTDI: IC4.77(PA15) ; also sheet 5
SYS_JTDO-SWO: IC4.89(PB3) ; also sheet 5
SYS_JTMS-SWDIO: IC4.72(PA13) ; also sheet 5
SYS_JTRST: IC4.90(PB4) ; also sheet 5
USART2_RX [uC]: IC4.26(PA3) ; also sheet 5
USART2_TX: IC4.25(PA2) ; also sheet 5
USART3_RX: IC4.79(PC11) ; also sheet 3,5
USART3_TX: IC4.78(PC10) ; also sheet 3,5
VBAT [uC]: IC4.6(VBAT)
VCAP_1: IC4.49(VCAP_1) ; also sheet 5
VCAP_2 [uC]: IC4.73(VCAP_2) ; also sheet 5
VDDA: IC4.21(VREF+) IC4.22(VDDA) ; also sheet 5
WAKE_UP: IC4.23(PA0)
Unconnected: IC4.7(PC13) IC4.8(PC14) IC4.9(PC15) IC4.15(PC0) IC4.16(PC1) IC4.17(PC2) IC4.18(PC3) IC4.24(PA1) IC4.33(PC4) IC4.35(PB0) IC4.36(PB1) IC4.37(PB2) IC4.38(PE7) IC4.39(PE8) IC4.40(PE9) IC4.41(PE10) IC4.56(PD9) IC4.60(PD13) IC4.61(PD14) IC4.62(PD15) IC4.68(PA9) IC4.69(PA10) IC4.70(PA11) IC4.71(PA12) IC4.80(PC12) IC4.81(PD0) IC4.82(PD1)

## Library data of the parts
+3V3 +5V +5V/1 +24V NET = COMPAQ:LED: LEDs Standard schematic elements and footprints for 5mm, 3mm, 1206, and 0603 sized LEDs. 5mm - Spark Fun Electronics SKU : COM-00529 (and others)
BTN1 = COMPAQ:SKQYACE010: Tactile Switches 6.1x3.7x2.5mm 100gf
BTN2 BTN3 = Pitot_ver2:SKQYACE010: Tactile Switches 6.1x3.7x2.5mm 100gf
C1 C4-C18 C21 C24 C25 C32 C33 C35 C36 C101 C102 C104-C110 C112 C113 C115 C116 = COMPAQ:CAPACITOR
C2 C3 C100 C103 C111 C114 = Capacitor:C-POL: Capacitor Polarised - Generic; CATEGORY: Capacitor
C19 C20 C26 C31 = Pitot_ver2:CAPACITOR
C38 = BEOND:CAPACITOR
CMC1 = COMPAQ:PE-1812ACC510STS: Common Mode Chokes / Filters AEC-Q200 Chip Choke 51uH 1Ohm Q200
D1 = SMF05C.TCT:SMF05C.TCT: Semtech SMF05C.TCT, Quint-Element Uni-Directional TVS Diode, 100W, 6-Pin SOT-363 (SC-70) Source: Datasheet <https://www.mouser.co.uk/datasheet/2/761/smf05c-1278099.pdf>; ARROW_PART_NUMBER: SMF05C.TCT; ARROW_PRICE-STOCK: https://www.arrow.com/en/products/smf05c.tct/semtech; DESCRIPTION: Semtech SMF05C.TCT, Quint-Element Uni-Directional TVS Diode, 100W, 6-Pin SOT-363 (SC-70); HEIGHT: 1.1mm; MANUFACTURER_NAME: SEMTECH; MANUFACTURER_PART_NUMBER: SMF05C.TCT; MOUSER_PART_NUMBER: 947-SMF05C.TCT; MOUSER_PRICE-STOCK: https://www.mouser.co.uk/ProductDetail/Semtech/SMF05CTCT?qs=rBWM4%252BvDhIcdGOAFdL4XAA%3D%3D
D2 = COMPAQ:SLV6A-FKB-CK1P1G1BB7R3R3: LED RGB DIFFUSED 6SMD
D100 = MasterBMS_ver1_1_Test:NRVTSS5100ET3G: Schottky Diodes & Rectifiers Low-Leakage Trench Schottky Rec
D101 = MasterBMS_ver1_1_Test:P0300SCLRP: Thyristor Surge Protection Devices (TSPD) 500A 25V
D102 D103 = EDZCVT2R6.8B:EDZCVT2R6.8B: ESD Suppressors / TVS Diodes TVS DIODE WITH SMALL MOLD PKG Source: Datasheet <https://d1d2qsbl8m0m72.cloudfront.net/en/products/databook/datasheet/discrete/diode/zener/edzcvt2r6.8b-e.pdf>; ARROW_PART_NUMBER: EDZCVT2R6.8B; DESCRIPTION: ESD Suppressors / TVS Diodes TVS DIODE WITH SMALL MOLD PKG; HEIGHT: 0.7mm; MANUFACTURER_NAME: ROHM Semiconductor; MANUFACTURER_PART_NUMBER: EDZCVT2R6.8B; MOUSER_PART_NUMBER: 755-EDZCVT2R6.8B; MOUSER_PRICE-STOCK: https://www.mouser.co.uk/ProductDetail/ROHM-Semiconductor/EDZCVT2R68B?qs=F5EMLAvA7IAPG8dd8GQNkw%3D%3D
FB1 = COMPAQ:FERRITE-BEAD
FB2 = BEOND:FERRITE-BEAD
FUSE100 FUSE101 = MasterBMS_ver1_1_Test:045201.5MRL: Surface Mount Fuses 125VAC 1.5A .093ohms 452 NANO2
I2C2_SCL I2C2_SDA S_+3V3 S_GND SPI1_MISO SPI1_MOSI SPI1_NSS SPI1_SCK U3_+3V3 U3_GND U_+3V3 U_GND USART2_RX USART2_TX USART3_RX USART3_TX = testpad:TP: Test pad
IC1 = COMPAQ:LM1117?-*: 800mA Low-Dropout Linear Regulator Source: http://www.ti.com/lit/ds/symlink/lm1117-n.pdf; MF: Texas Instruments; MPN: LM1117MP-1.8; OC_FARNELL: 1469053; OC_NEWARK: 41K3467
IC2 = COMPAQ:TJA1052IT/2Y: CAN Interface IC TJA1052IT/2/SO16/REEL 13" Q1/T Source: Datasheet <http://cache.nxp.com/documents/data_sheet/TJA1052I.pdf?pspll=1/.PDF>; DESCRIPTION: CAN Interface IC TJA1052IT/2/SO16/REEL 13" Q1/T; HEIGHT: 2.65mm; MANUFACTURER_NAME: Nexperia; MANUFACTURER_PART_NUMBER: TJA1052IT/2Y; MOUSER_PART_NUMBER: 771-TJA1052IT/2Y; MOUSER_PRICE-STOCK: https://www.mouser.com/Search/Refine.aspx?Keyword=771-TJA1052IT%2F2Y
IC3 = TXB0108PWR:TXB0108PWR: 8-Bit Bidirectional Voltage-Level Shifter with Auto Direction Sensing and +/-15-kV ESD Protect Source: Datasheet <http://www.ti.com/lit/ds/symlink/txb0108.pdf>; ARROW_PART_NUMBER: TXB0108PWR; ARROW_PRICE-STOCK: https://www.arrow.com/en/products/txb0108pwr/texas-instruments; DESCRIPTION: 8-Bit Bidirectional Voltage-Level Shifter with Auto Direction Sensing and +/-15-kV ESD Protect; HEIGHT: 1.2mm; MANUFACTURER_NAME: Texas Instruments; MANUFACTURER_PART_NUMBER: TXB0108PWR; MOUSER_PART_NUMBER: 595-TXB0108PWR; MOUSER_PRICE-STOCK: https://www.mouser.co.uk/ProductDetail/Texas-Instruments/TXB0108PWR?qs=oFXvjAmG9EgEUWGWzOVFCA%3D%3D
IC4 = MasterBMS_ver1_2+IoT:STM32F439VIT6: 32-Bit MCU+FPU M4 2MB LCD-TFT LQFP100 STM32F439VIT6, 32 bit ARM Cortex M4 MCU 180MHz 2048 kB Flash, 256 kB RAM, 2xUSB CAN I2C 100-Pin LQFP Source: Datasheet <http://www.st.com/web/en/resource/technical/document/datasheet/DM00077036.pdf>; DESCRIPTION: 32-Bit MCU+FPU M4 2MB LCD-TFT LQFP100 STM32F439VIT6, 32 bit ARM Cortex M4 MCU 180MHz 2048 kB Flash, 256 kB RAM, 2xUSB CAN I2C 100-Pin LQFP; HEIGHT: 1.6mm; MANUFACTURER_NAME: STMicroelectronics; MANUFACTURER_PART_NUMBER: STM32F439VIT6; MOUSER_PART_NUMBER: 511-STM32F439VIT6; MOUSER_PRICE-STOCK: https://www.mouser.co.uk/ProductDetail/STMicroelectronics/STM32F439VIT6?qs=DqCdCwOw4%2F4iiDi2TCbfOA%3D%3D
IC5 = LP3856ES-3.3:LP3856ES-3.3: Linear regulators Source: Datasheet; ARROW_PART_NUMBER: LP3856ES-3.3; ARROW_PRICE-STOCK: https://www.arrow.com/en/products/lp3856es-3.3/texas-instruments; DESCRIPTION: Linear regulators; HEIGHT: mm; MANUFACTURER_NAME: Texas Instruments; MANUFACTURER_PART_NUMBER: LP3856ES-3.3; MOUSER_PART_NUMBER: 926-LP3856ES-33; MOUSER_PRICE-STOCK: https://www.mouser.co.uk/ProductDetail/Texas-Instruments/LP3856ES-33?qs=1FNqv8aZn1SSy9T9faTYMw%3D%3D
IC101 = COMPAQ:NCV4274CST50T3G: LDO LDO Voltage Regulators 5.0V/400MA LDO + Tab-Pin SOT-223
J1 = COMPAQ:34792-0040: Automotive Connectors 4P 1R MINI50 HEADER VERT UNSEALED BLACK Source: Datasheet <https://componentsearchengine.com/Datasheets/2/34792-0040.pdf>; ALLIED_NUMBER: 71458124; ALLIED_PRICE-STOCK: https://www.alliedelec.com/molexincorporated-34792-0040/71458124/; DESCRIPTION: Automotive Connectors 4P 1R MINI50 HEADER VERT UNSEALED BLACK; HEIGHT: 14.6mm; MANUFACTURER_NAME: Molex; MANUFACTURER_PART_NUMBER: 34792-0040; MOUSER_PART_NUMBER: 538-34792-0040; MOUSER_PRICE-STOCK: https://www.mouser.com/Search/Refine.aspx?Keyword=538-34792-0040; RS_PART_NUMBER: 1789341; RS_PRICE-STOCK: http://uk.rs-online.com/web/p/products/1789341
J2 = 693043020611:693043020611: Memory Card Connectors WR-CRD Nano SIM SMT 1.2mm Push/Pull Source: Datasheet <http://katalog.we-online.de/em/datasheet/693043020611.pdf>; DESCRIPTION: Memory Card Connectors WR-CRD Nano SIM SMT 1.2mm Push/Pull; HEIGHT: mm; MANUFACTURER_NAME: Wurth Elektronik; MANUFACTURER_PART_NUMBER: 693043020611; MOUSER_PART_NUMBER: 710-693043020611; MOUSER_PRICE-STOCK: https://www.mouser.co.uk/ProductDetail/Wurth-Elektronik/693043020611?qs=a9WhcLg8qCwC%2FpVEDAdA2Q%3D%3D
J3 = MasterBMS_ver1_2+IoT:FTSH-105-01-L-DV-K-P-TR: Samtec FTSH, 1.27mm Pitch, 10 Way, 2 Row PCB Terminal Block Header, Surface Mount, Through Hole Source: Datasheet <http://suddendocs.samtec.com/prints/ftsh-1xx-xx-xxx-dv-xxx-xxx-mkt.pdf>; DESCRIPTION: Samtec FTSH, 1.27mm Pitch, 10 Way, 2 Row PCB Terminal Block Header, Surface Mount, Through Hole; HEIGHT: 12mm; MANUFACTURER_NAME: SAMTEC; MANUFACTURER_PART_NUMBER: FTSH-105-01-L-DV-K-P-TR; MOUSER_PART_NUMBER: 200-FTSH10501LDVKPTR; MOUSER_PRICE-STOCK: https://www.mouser.com/Search/Refine.aspx?Keyword=200-FTSH10501LDVKPTR; RS_PART_NUMBER: 1802905P; RS_PRICE-STOCK: http://uk.rs-online.com/web/p/products/1802905P
J100 = MasterBMS_ver1_1_Test:DM3AT-SF-PEJM5_42_: Memory Card Connectors SD R/A PUSH-PUSH SMD CONN MICRO Source: Datasheet <https://www.hirose.com/product/document?clcode=CL0609-0031-0-00&productname=DM3AT-SF-PEJM5&series=DM3&documenttype=2DDrawing&lang=en&documentid=0000947170>; DESCRIPTION: Memory Card Connectors SD R/A PUSH-PUSH SMD CONN MICRO; HEIGHT: 1.83mm; MANUFACTURER_NAME: Hirose; MANUFACTURER_PART_NUMBER: DM3AT-SF-PEJM5(42); MOUSER_PART_NUMBER: 798-DM3AT-SF-PEJM542; MOUSER_PRICE-STOCK: https://www.mouser.com/Search/Refine.aspx?Keyword=798-DM3AT-SF-PEJM542
J101 = COMPAQ:1775838-2: PCI Express / PCI Connectors mSATA/mini PCI-E 5.6H Type I G/F Source: Datasheet <http://www.te.com/commerce/DocumentDelivery/DDEController?Action=showdoc&DocId=Customer Drawing1775838HpdfEnglishENG_CD_1775838_H.pdf1775838-2>
J102 = MasterBMS_ver1_1_Test:105017-0001; AVAILABILITY: Unavailable; DESCRIPTION: USB - micro B USB 2.0 Receptacle Connector 5 Position Surface Mount, Right Angle; Through Hole; MF: Molex; MP: 105017-0001; PACKAGE: None; PRICE: None
L100 = MasterBMS_ver1_1_Test:SRN5020TA-5R6M: Fixed Inductors 5.6uH 20% 2.1A
M1-M3 = COMPAQ:2N7002NXAKR: MOSFET 60 V, single N-channel Trench MOSFET
PS1 = THN_15-2411WIR:THN_15-2411WIR: 15 Watt DC/DC converter, railway, 4:1 input incl. 110 VDC nominal, high temperature range, encapsulated, 1.0" x 1.0" metal package Source: Datasheet <http://www.farnell.com/datasheets/2828654.pdf>; DESCRIPTION: 15 Watt DC/DC converter, railway, 4:1 input incl. 110 VDC nominal, high temperature range, encapsulated, 1.0" x 1.0" metal package; HEIGHT: 10.4mm; MANUFACTURER_NAME: Traco Power; MANUFACTURER_PART_NUMBER: THN 15-2411WIR; MOUSER_PART_NUMBER: 495-THN15-2411WIR; MOUSER_PRICE-STOCK: https://www.mouser.co.uk/ProductDetail/TRACO-Power/THN-15-2411WIR?qs=YCa%2FAAYMW022O0HDwGnJBg%3D%3D
Q1 = COMPAQ:MMBT3904VL: MMBT3904 - NPN switching transistor Source: Datasheet <http://assets.nexperia.com/documents/data-sheet/MMBT3904.pdf>; ARROW_PART_NUMBER: MMBT3904VL; ARROW_PRICE-STOCK: https://www.arrow.com/en/products/mmbt3904vl/nexperia; DESCRIPTION: MMBT3904 - NPN switching transistor; HEIGHT: 1.1mm; MANUFACTURER_NAME: Nexperia; MANUFACTURER_PART_NUMBER: MMBT3904VL; MOUSER_PART_NUMBER: 771-MMBT3904VL; MOUSER_PRICE-STOCK: https://www.mouser.co.uk/ProductDetail/Nexperia/MMBT3904VL?qs=cnAQGvEIVkKbCwIpHJoHxQ%3D%3D
R1-R13 R15 R19-R34 R37-R39 R100 R103-R106 = COMPAQ:RESISTOR
R14 R16-R18 = Pitot_ver2:RESITOR
R35 R36 = MasterBMS_ver1_2+IoT:RESITOR
TVS100 = COMPAQ:PESD1CAN,215: ESD Suppressors / TVS Diodes CAN BUS ESD PROTECT
U1 = COMPAQ:ESD401DPYR: 1-Channel ESD Protection Diode Source: Datasheet <http://www.ti.com/lit/ds/symlink/esd401.pdf>; ARROW_PART_NUMBER: ESD401DPYR; ARROW_PRICE-STOCK: https://www.arrow.com/en/products/esd401dpyr/texas-instruments; DESCRIPTION: 1-Channel ESD Protection Diode; HEIGHT: 0.5mm; MANUFACTURER_NAME: Texas Instruments; MANUFACTURER_PART_NUMBER: ESD401DPYR; MOUSER_PART_NUMBER: 595-ESD401DPYR; MOUSER_PRICE-STOCK: https://www.mouser.co.uk/ProductDetail/Texas-Instruments/ESD401DPYR?qs=BZBei1rCqCCvWkwMToOW3Q%3D%3D
Y1 = MasterBMS_ver1_2+IoT:NX3225GD-8MHZ-STD-CRA-3: A small surface-mount type crystal unit, ideal for an engine control CPU clock; delivering the high reliability that is particularly demanded by automotive Source: Datasheet <http://www.ndk.com/images/products/catalog/c_NX3225GD-STD-CRA-3_e.pdf>; DESCRIPTION: A small surface-mount type crystal unit, ideal for an engine control CPU clock; delivering the high reliability that is particularly demanded by automotive; HEIGHT: 1mm; MANUFACTURER_NAME: NDK; MANUFACTURER_PART_NUMBER: NX3225GD-8MHZ-STD-CRA-3; MOUSER_PART_NUMBER: 344-NX3225GD8MCRA3; MOUSER_PRICE-STOCK: https://www.mouser.com/Search/Refine.aspx?Keyword=344-NX3225GD8MCRA3; RS_PART_NUMBER: 1847983; RS_PRICE-STOCK: http://uk.rs-online.com/web/p/products/1847983

## Net classes
0 default: width 0.203 mm, drill 0.2 mm, clearance 0.203 mm
3 uC: width 0.203 mm, drill 0.2 mm, clearance 0.203 mm
9 24v: width 0.61 mm, drill 0.2 mm, clearance 0.203 mm